# EasyEDA Pro project ProPrj_秋水小车_2026-03-26.epro

# Schematic Schematic1
Board Name: Board1; Create Date: 2025-11-21; Page Name: P1; Project Name: 秋水小车; Schematic Name: Schematic1; Update Date: 2025-11-22; Company: 嘉立创EDA; Page Size: A4; Version: V1.0
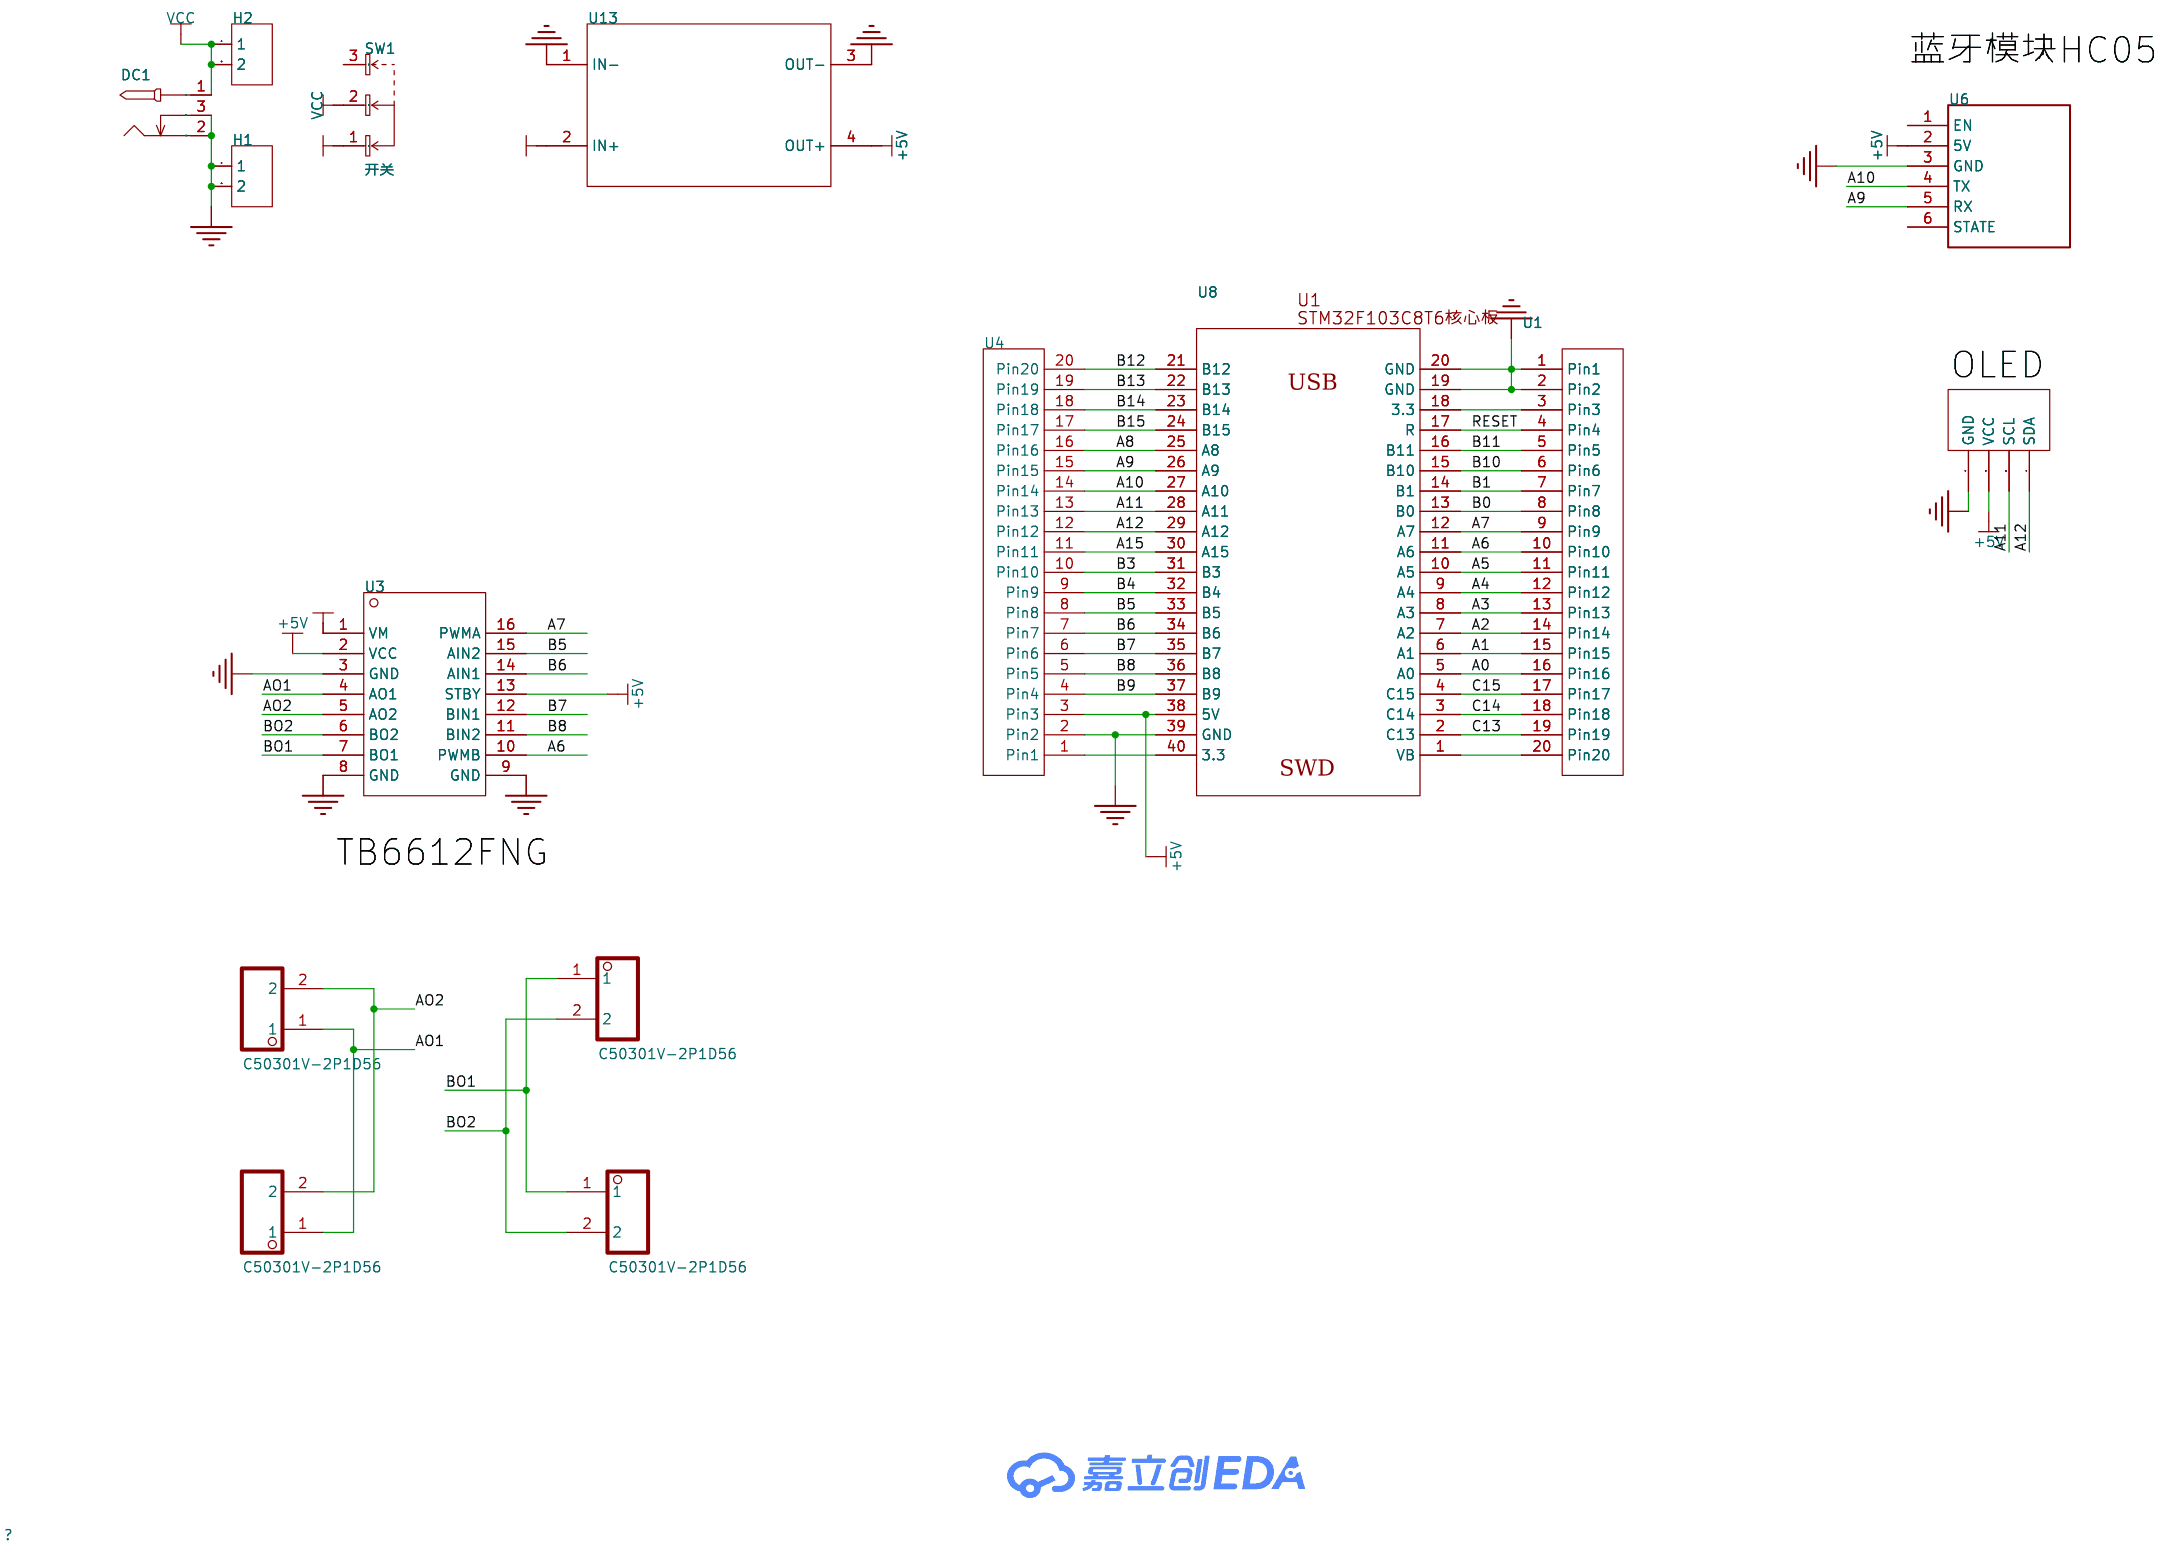
[diagram p0: schematic sheet]

## Parts
DC1  -  [DC-005_2.5]
H1  -  [HDR-TH_2P-P2.54-V-F]
H2  -  [HDR-TH_2P-P2.54-V-F]
OLED  OLED4PIN  [OLED 4PIN]
SW1  开关  [SW-TH_3P-P4.70_L11.1-W12.7]
U1  -  [20p排针]
U3  TB6612FNG  [TB6612]
U4  -  [20p排针]
U6  蓝牙模块HC05  [HC05]
U8  -  [STM32F103C8T6核心板]
U9  C50301V-2P1D56  [螺钉式接线端子]
U10  C50301V-2P1D56  [螺钉式接线端子]
U11  C50301V-2P1D56  [螺钉式接线端子]
U12  C50301V-2P1D56  [螺钉式接线端子]
U13  -  [MP1584en]

## Library data of the parts
DC1 = DC-005_2.5: Supplier Footprint: 插件
H1 H2 = HDR-F_2.54_1x2P: Supplier Part: C49661; Supplier Footprint: 插件
OLED = OLED 4PIN: _: 3
SW1 = SS-12D06L5: 电路结构:单刀双掷;安装方式:-;开关颜色:黑色;额定电流:3A;额定电压:250V;工作寿命:1万次;; LCSC Part Name: 柄长5mm 卧插双档 滑动开关; Supplier Part: C319015; Manufacturer: XKB Connection(中国星坤); Supplier Footprint: 插件,13x6.6mm; JLCPCB Part Class: 扩展库; Datasheet: https://item.szlcsc.com/datasheet/SS-12D06L5/300107.html; Supplier: LCSC; Circuit: 单刀双掷; Actuator Style: 矩形柱状; Termination Style: PC引脚; Length: 12.95mm; Width: 6.6mm; Switch Height: 6.3mm; Actuator Color: 黑色; Current Rating: 3A; Voltage Rating: 250V; Life: 1万次; Operating Temperature: -40℃~+85℃
U1 U4 = 20p排针
U3 = TB6612
U6 = HC05
U8 = STM32F103核心板
U9-U12 = 螺钉式接线端子: 低价方案
U13 = MP1584en

## Nets
+5V: OLED.2(VCC) U3.2(VCC) U3.13(STBY) U4.3(Pin3) U6.2(5V) U8.38(5V) U13.4(OUT+)
+12V: SW1.1 U3.1(VM) U13.2(IN+)
GND: DC1.2 DC1.3 H1.1 H1.2 OLED.1(GND) U1.1(Pin1) U1.2(Pin2) U3.3(GND) U3.8(GND) U3.9(GND) U4.2(Pin2) U6.3(GND) U8.19(GND) U8.20(GND) U8.39(GND) U13.1(IN-) U13.3(OUT-)
VCC: DC1.1(4) H2.1 H2.2 SW1.2
A0: U1.16(Pin16) U8.5(A0)
A1: U1.15(Pin15) U8.6(A1)
A2: U1.14(Pin14) U8.7(A2)
A3: U1.13(Pin13) U8.8(A3)
A4: U1.12(Pin12) U8.9(A4)
A5: U1.11(Pin11) U8.10(A5)
A6: U1.10(Pin10) U3.10(PWMB) U8.11(A6)
A7: U1.9(Pin9) U3.16(PWMA) U8.12(A7)
A8: U4.16(Pin16) U8.25(A8)
A9: U4.15(Pin15) U6.5(RX) U8.26(A9)
A10: U4.14(Pin14) U6.4(TX) U8.27(A10)
A11: OLED.3(SCL) U4.13(Pin13) U8.28(A11)
A12: OLED.4(SDA) U4.12(Pin12) U8.29(A12)
A15: U4.11(Pin11) U8.30(A15)
AO1: U3.4(AO1) U9.1 U10.1
AO2: U3.5(AO2) U9.2 U10.2
B0: U1.8(Pin8) U8.13(B0)
B1: U1.7(Pin7) U8.14(B1)
B3: U4.10(Pin10) U8.31(B3)
B4: U4.9(Pin9) U8.32(B4)
B5: U3.15(AIN2) U4.8(Pin8) U8.33(B5)
B6: U3.14(AIN1) U4.7(Pin7) U8.34(B6)
B7: U3.12(BIN1) U4.6(Pin6) U8.35(B7)
B8: U3.11(BIN2) U4.5(Pin5) U8.36(B8)
B9: U4.4(Pin4) U8.37(B9)
B10: U1.6(Pin6) U8.15(B10)
B11: U1.5(Pin5) U8.16(B11)
B12: U4.20(Pin20) U8.21(B12)
B13: U4.19(Pin19) U8.22(B13)
B14: U4.18(Pin18) U8.23(B14)
B15: U4.17(Pin17) U8.24(B15)
BO1: U3.7(BO1) U11.1 U12.1
BO2: U3.6(BO2) U11.2 U12.2
C13: U1.19(Pin19) U8.2(C13)
C14: U1.18(Pin18) U8.3(C14)
C15: U1.17(Pin17) U8.4(C15)
RESET: U1.4(Pin4) U8.17(R)
$1N2688: U1.3(Pin3) U8.18(3.3)
$1N2777: U1.20(Pin20) U8.1(VB)
$1N2896: U4.1(Pin1) U8.40(3.3)

Not connected (* = marked no-connect by the designer): SW1 3; U6 1(EN) 6(STATE)

# Board PCB1
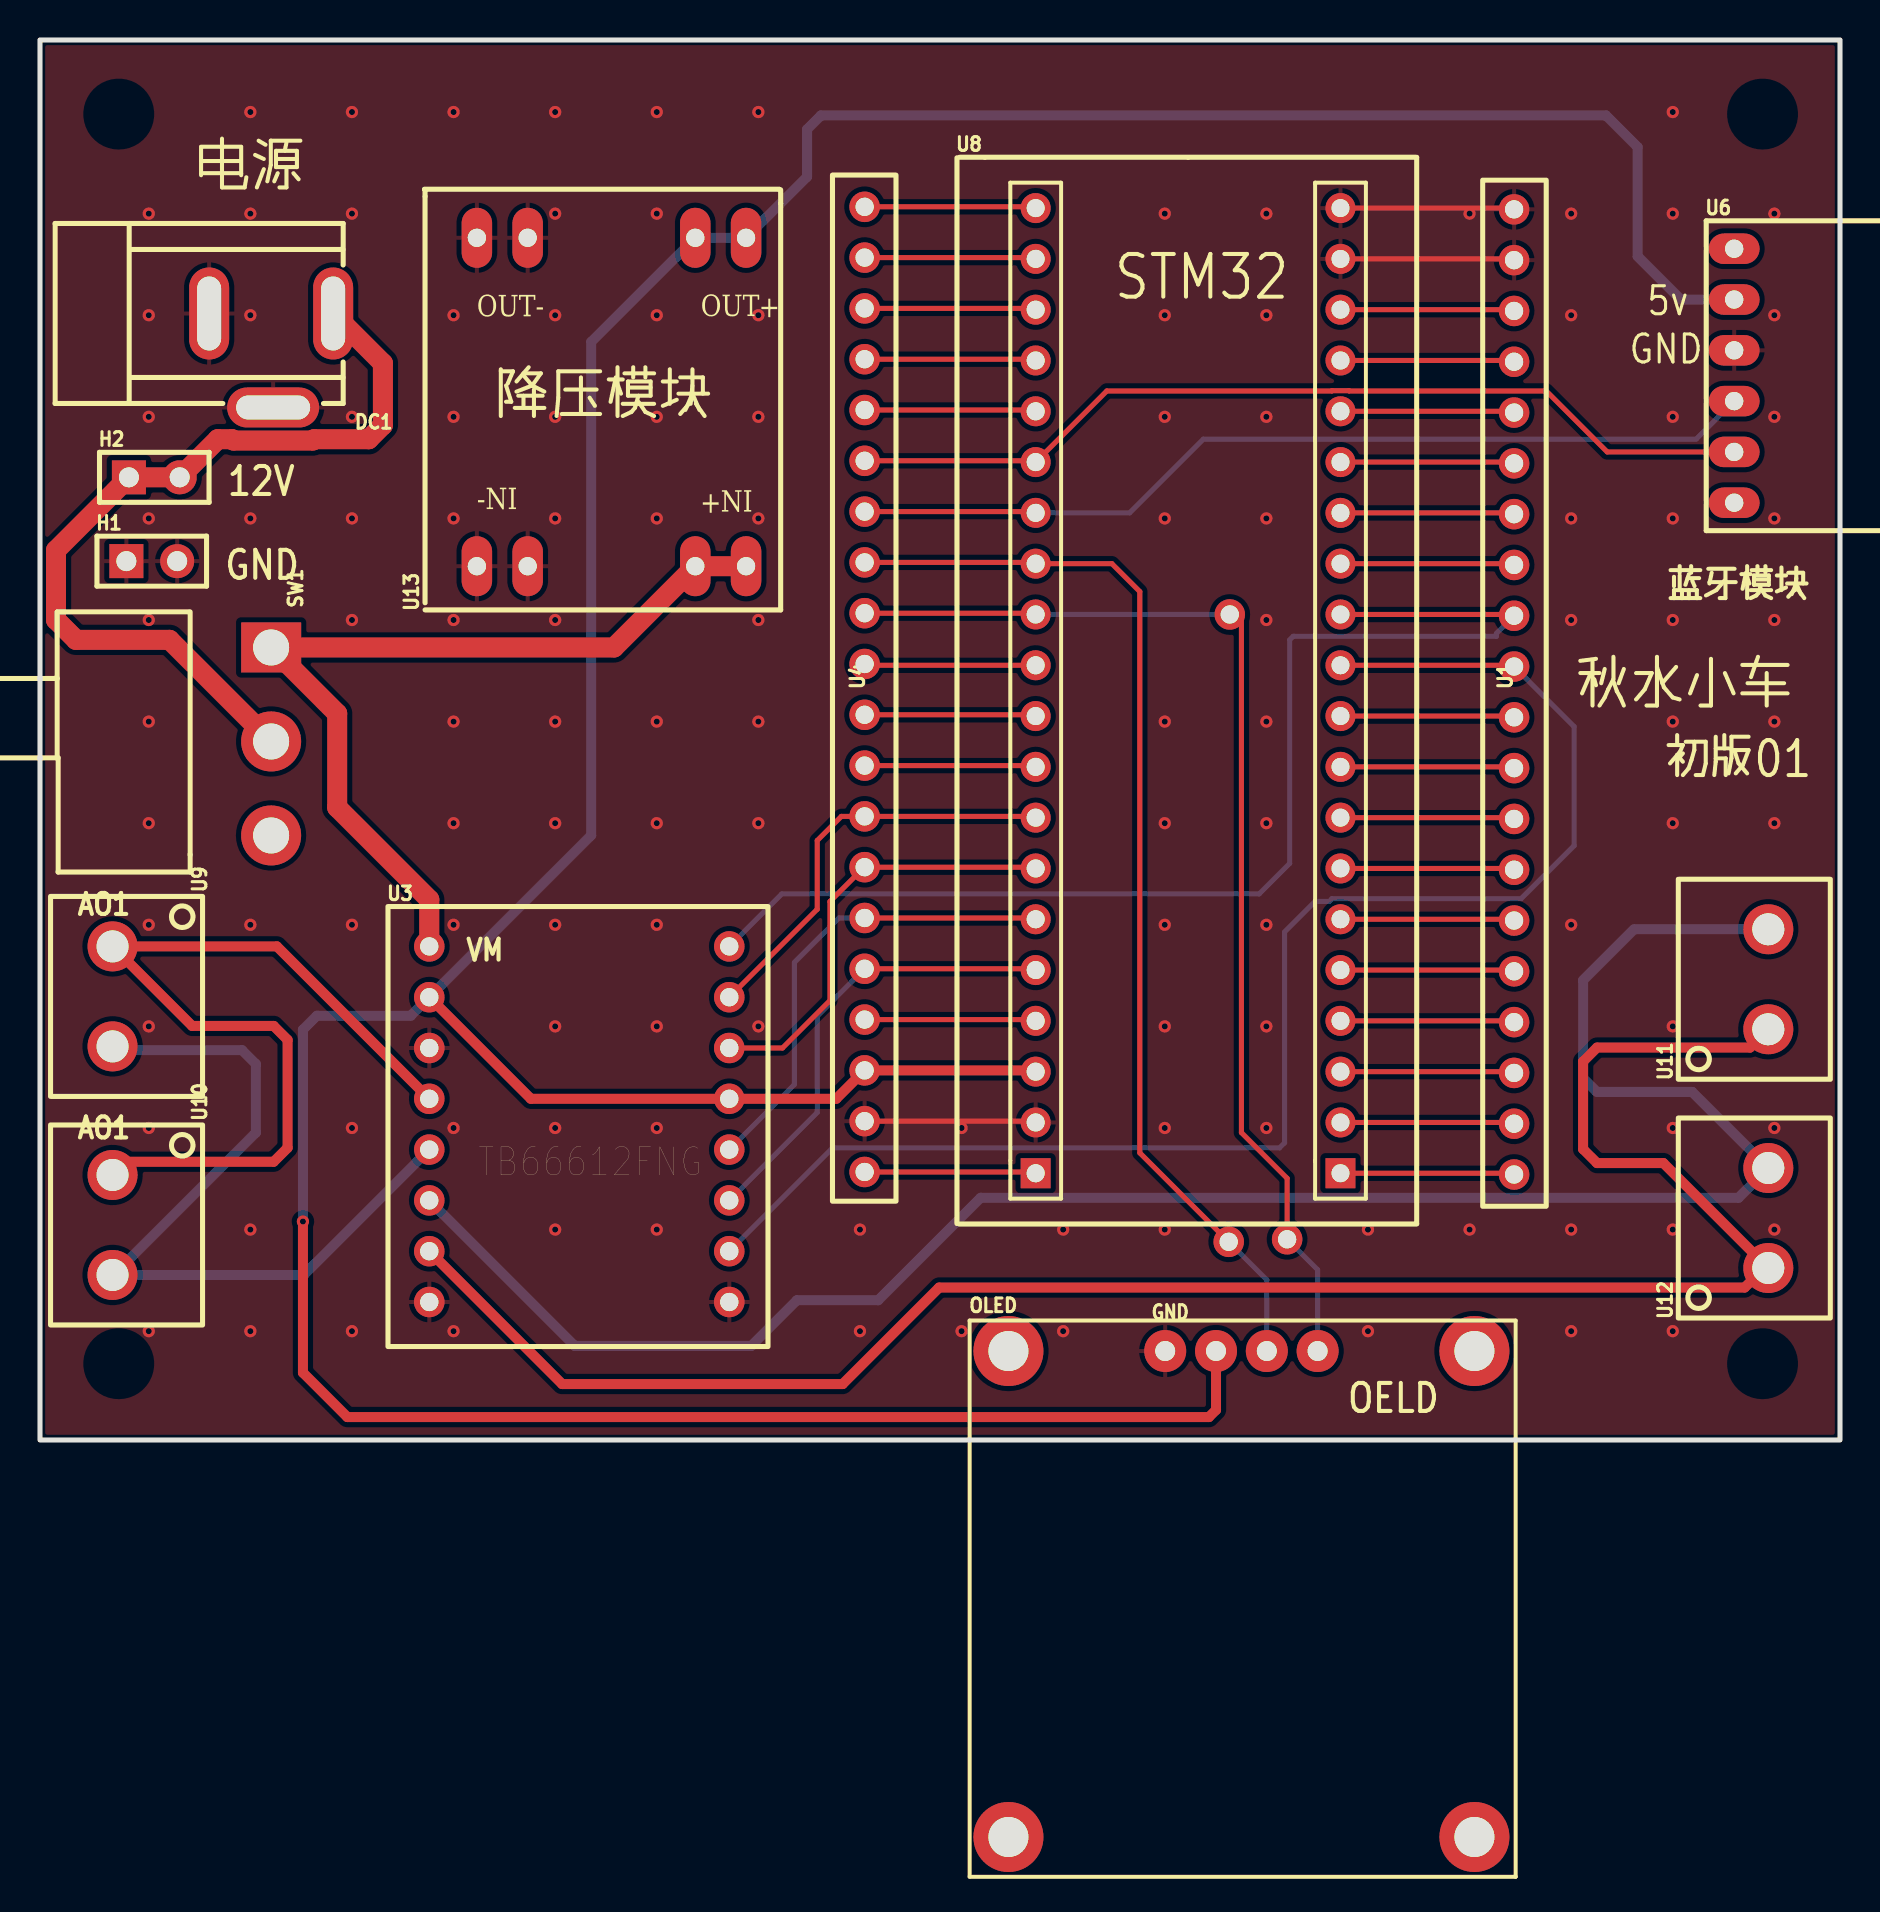
[diagram p1: board, top side]
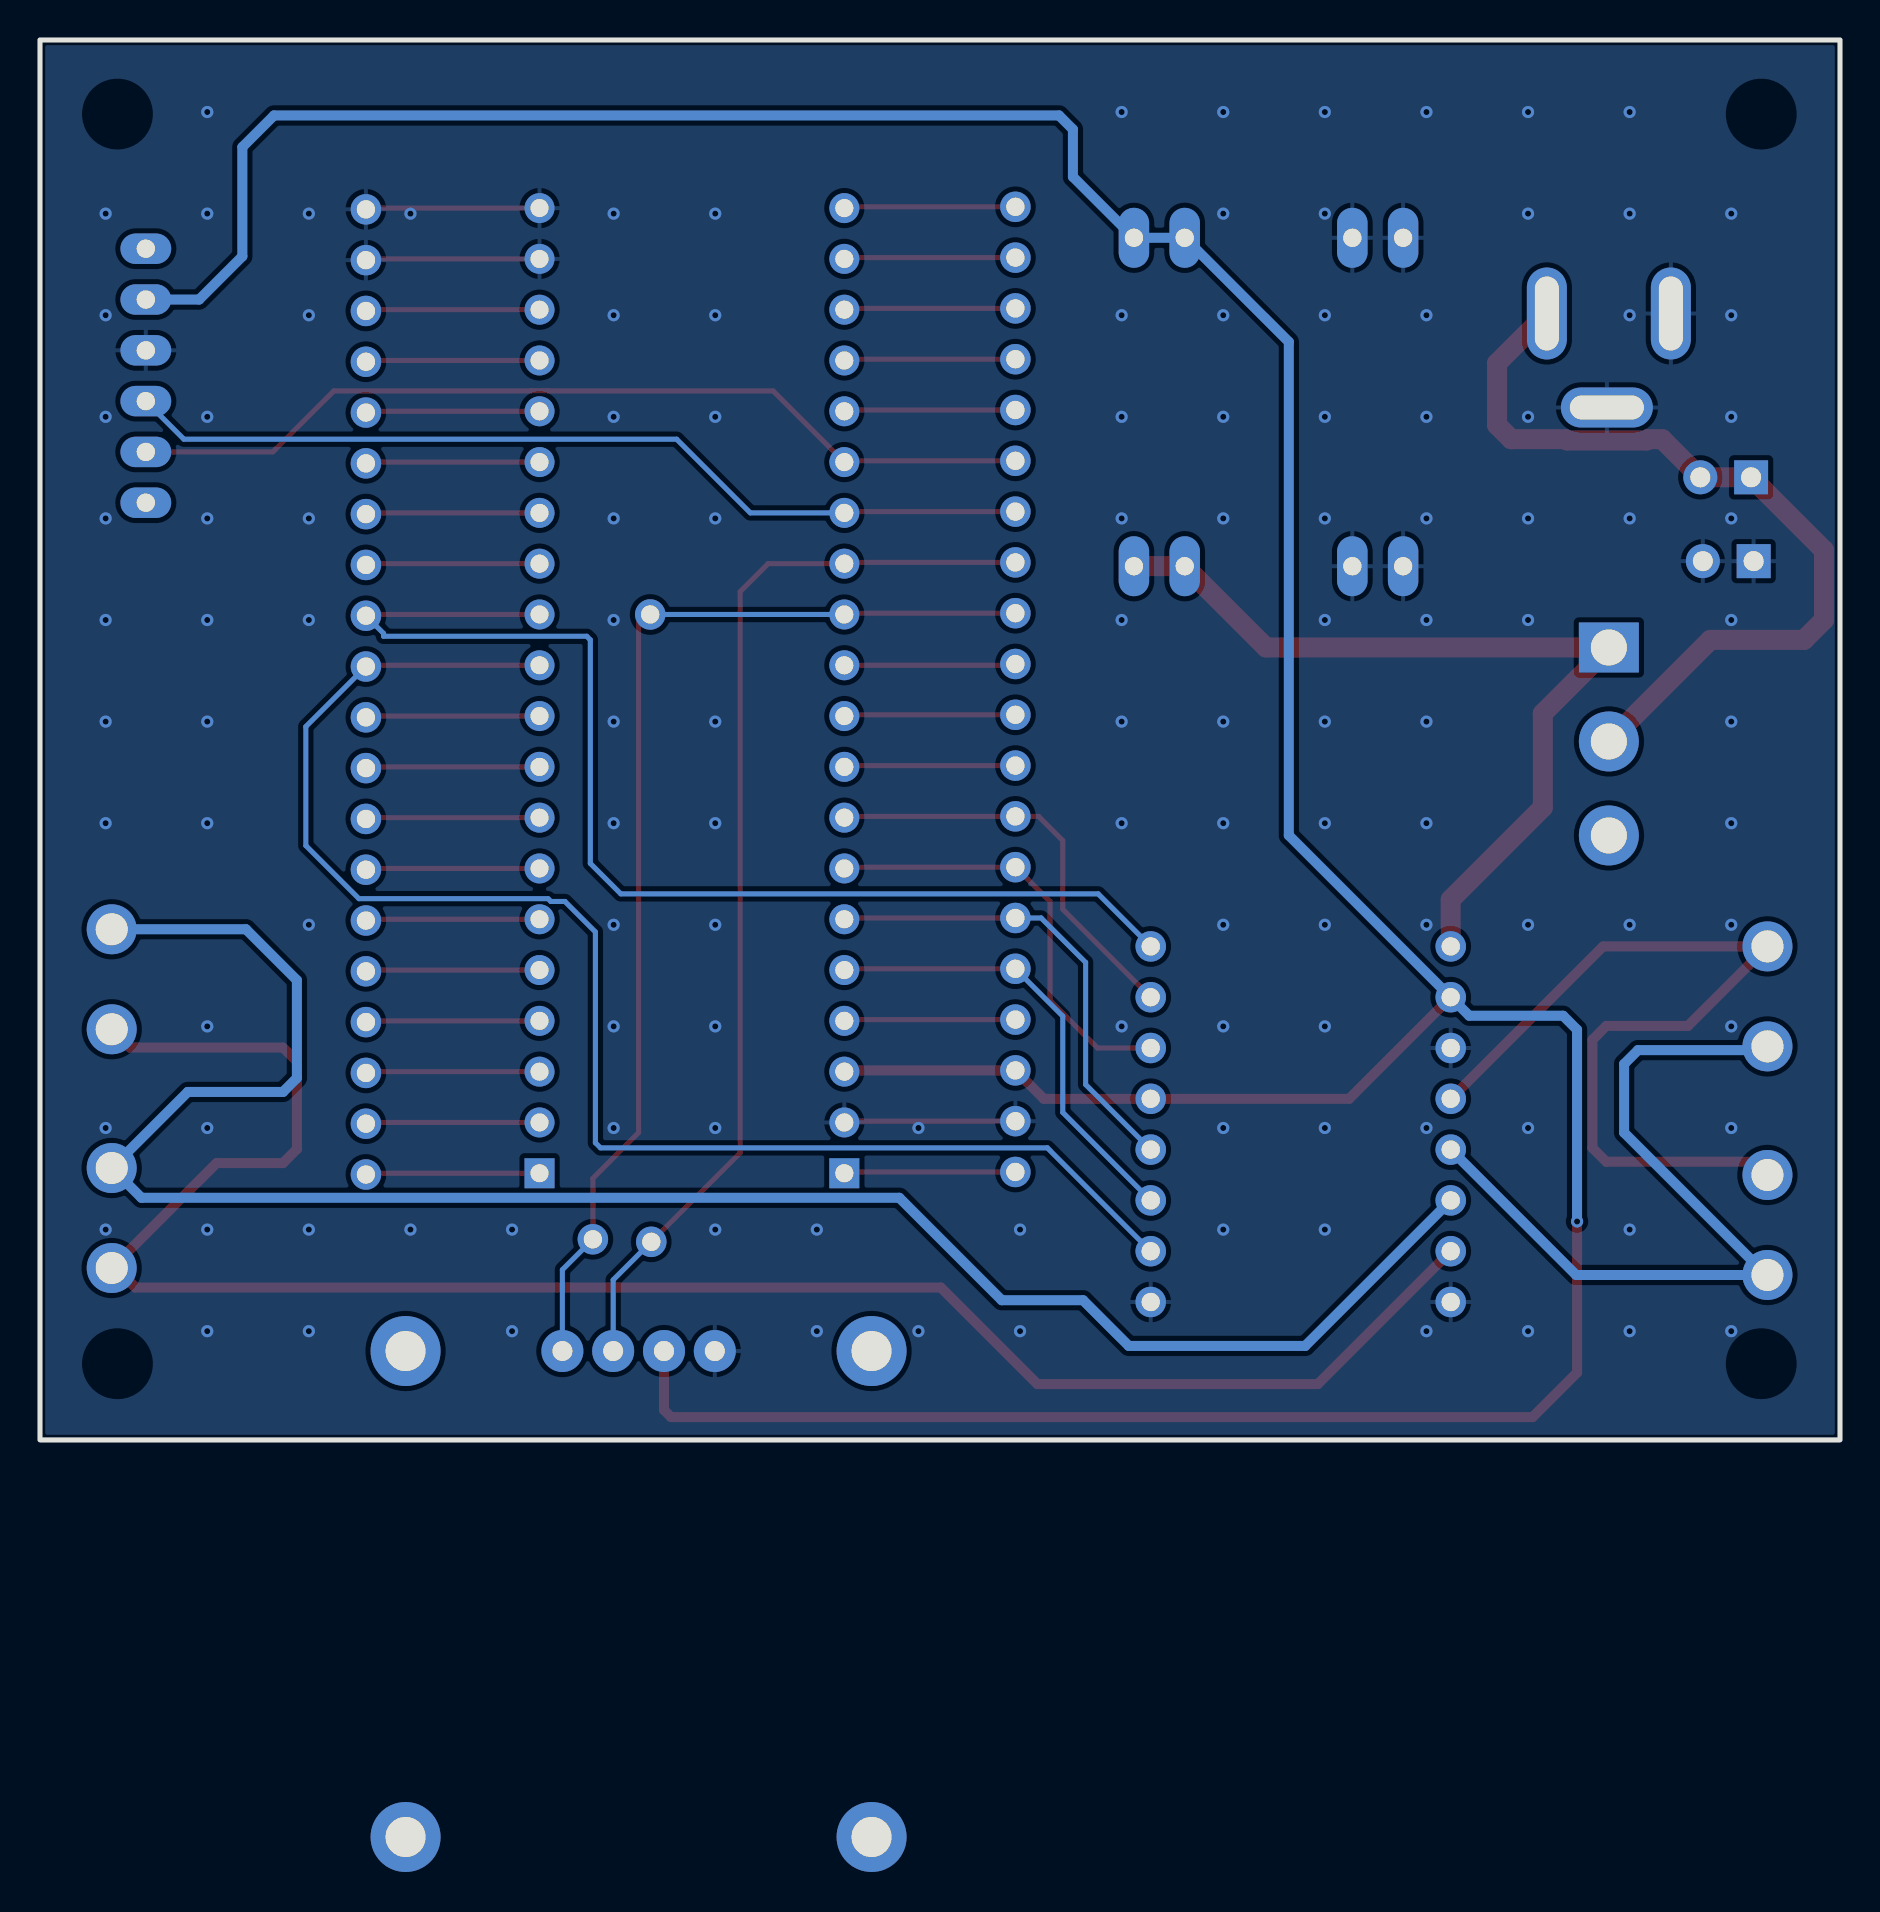
[diagram p2: board, bottom side, seen from below]

Outline 90 x 70 mm; copper layers: Top Layer, Bottom Layer. Coordinates in mm from the lower left corner of the outline.
Outline path: rectangle 0,70 90,0
Stack: Top Layer 0.035mm / Dielectric1 1.51mm FR4 er 4.5 / Bottom Layer 0.035mm

## Design rules (mm)
template: JLCPCB Capability(Two Layers Board)
spacing copperThickness1oz (default): track to track 0.102, other pairs 0.152 to 0.3
spacing copperThickness2oz: track to track 0.203, other pairs 0.152 to 0.3
track width copperThickness1oz (default): min 0.127, default 0.254, max 2.54
track width copperThickness2oz: min 0.203, default 0.254, max 2.54
differential pair differentialPair (default): width min 0.127, default 0.254, max 2.54; gap min 0.152, default 0.152
via viaSize (default): diameter min 0.5, default 0.61, max 10; hole min 0.3, default 0.305, max 6.3

## Placement (name value [footprint] x y rotation side)
DC1  -  [DC-005_2.5]  11.43 56.01 180 top
H1  -  [HDR-TH_2P-P2.54-V-F]  5.59 43.94 0 top
H2  -  [HDR-TH_2P-P2.54-V-F]  5.72 48.13 0 top
NOREF  -  [Pad_e2007]  59.44 9.91 0 top
NOREF#2  -  [Pad_e2040]  59.49 41.27 0 top
NOREF#3  -  [Pad_e2032]  62.36 10.03 0 top
OLED  OLED4PIN  [OLED 4PIN]  56.26 4.44 0 top
SW1  开关  [SW-TH_3P-P4.70_L11.1-W12.7]  11.56 34.92 270 top
U1  -  [20p排针]  73.66 37.46 270 top
U3  TB6612FNG  [TB6612]  29.46 19.18 0 top
U4  -  [20p排针]  41.28 37.46 90 top
U6  蓝牙模块HC05  [HC05]  84.71 59.56 0 top
U8  -  [STM32F103C8T6核心板]  45.72 10.82 0 top
U9  C50301V-2P1D56  [螺钉式接线端子]  8.13 27.18 270 top
U10  C50301V-2P1D56  [螺钉式接线端子]  8.13 15.75 270 top
U11  C50301V-2P1D56  [螺钉式接线端子]  81.91 18.03 90 top
U12  C50301V-2P1D56  [螺钉式接线端子]  81.91 6.1 90 top
U13  -  [MP1584en]  21.84 43.69 90 top

## Footprints (pads in the part's own frame, mm; a bottom-side part is the same pattern mirrored in y, then rotated)
20p排针
  round 1.524 hole 0.914: 1(-24.067,0.044) 2(-21.526,0.044) 3(-18.986,0.044) 4(-16.447,0.044) 5(-13.906,0.044) 6(-11.367,0.044) 7(-8.826,0.044) 8(-6.287,0.044) 9(-3.747,0.044) 10(-1.206,0.044) 11(1.333,0.044) 12(3.873,0.044) 13(6.413,0.044) 14(8.954,0.044) 15(11.493,0.044) 16(14.034,0.044) 17(16.573,0.044) 18(19.113,0.044) 19(21.654,0.044) 20(24.194,0.044)
DC-005_2.5
  oval 2x4.6 hole 1.2x3.7: 1(-3.227,-0.318) 2(2.973,-0.318)
  oval 4.6x2 hole 3.7x1.2: 3(-0.227,4.382)
HC05
  oval 2.54x1.524 hole 0.914: 1(0,0) 2(0,-2.54) 3(0,-5.08) 4(0,-7.62) 5(0,-10.16) 6(0,-12.7)
HDR-TH_2P-P2.54-V-F
  rect 1.7x1.7 hole 1: 1(-1.27,0)
  round 1.7 hole 1: 2(1.27,0)
MP1584en
  oval 2.999x1.524 hole 0.914: 1(0,0) 1(0,-2.54) 2(0,-10.919) 2(0,-13.46) 3(16.421,0) 3(16.421,-2.54) 4(16.421,-10.919) 4(16.421,-13.46)
OLED 4PIN
  round 3.5 hole 2: 0(-7.84,0) 0(-7.84,-24.3) 0(15.46,0) 0(15.46,-24.3)
  round 2.1 hole 1: 1(0,0) 2(2.54,0) 3(5.08,0) 4(7.62,0)
Pad_e2007
  round 1.524 hole 0.914: 1(0,0)
Pad_e2032
  round 1.524 hole 0.914: 1(0,0)
Pad_e2040
  round 1.524 hole 0.914: 1(0,0)
STM32F103C8T6核心板
  rect 1.5x1.5 hole 0.9: 1(19.304,2.514)
  round 1.5 hole 0.9: 2(19.304,5.054) 3(19.304,7.595) 4(19.304,10.134) 5(19.304,12.675) 6(19.304,15.214) 7(19.304,17.755) 8(19.304,20.294) 9(19.304,22.834) 10(19.304,25.375) 11(19.304,27.915) 12(19.304,30.454) 14(19.304,35.535) 18(19.304,45.694) 19(19.304,48.234) 20(19.304,50.775)
  round 1.5 hole 0.9x0.905: 13(19.304,32.995) 15(19.304,38.075) 16(19.304,40.614) 17(19.304,43.154) 21(4.064,50.775) 22(4.064,48.234) 23(4.064,45.694) 24(4.064,43.154) 25(4.064,40.614) 26(4.064,38.075) 27(4.064,35.535) 28(4.064,32.995) 29(4.064,30.454) 30(4.064,27.915) 31(4.064,25.375) 32(4.064,22.834) 33(4.064,20.294) 34(4.064,17.755) 35(4.064,15.214) 36(4.064,12.675) 37(4.064,10.134) 38(4.064,7.595) 39(4.064,5.054)
  rect 1.5x1.5 hole 0.9x0.905: 40(4.064,2.514)
SW-TH_3P-P4.70_L11.1-W12.7
  rect 2.5x3 hole 1.8: 1(-4.7,0)
  round 3 hole 1.8: 2(0,0) 3(4.7,0)
TB6612
  round 1.524 hole 0.914: 1(-10,5.5) 2(-10,2.96) 3(-10,0.42) 4(-10,-2.12) 5(-10,-4.66) 6(-10,-7.2) 7(-10,-9.74) 8(-10,-12.28) 9(5,-12.28) 10(5,-9.74) 11(5,-7.2) 12(5,-4.66) 13(5,-2.12) 14(5,0.42) 15(5,2.96) 16(5,5.5)
螺钉式接线端子
  round 2.5 hole 1.6: 1(2.5,-4.5) 2(7.5,-4.5)

## Nets
As in the schematic, except:
A11: NOREF.1 OLED.3 U4.13 U8.28
A12: NOREF#2.1 NOREF#3.1 OLED.4 U4.12 U8.29

Pads without a net: OLED 0; SW1 3; U6 1 6

## Via types
v1: diameter 0.61, hole 0.305, Top Layer to Bottom Layer, 125 vias

## Routing (per net, layer and track width the routed paths; a pad name or vN(x,y) marks a point on that pad's centre or on a via; arc(x,y) is an arc through that point)
+5V: length 213.2
  Top Layer w0.5: OLED.2 58.8,1.5 58.45,1.14 15.37,1.14 13.15,3.36 v1(13.15,10.92) ; U8.38 49.72,18.48 U4.3 39.81,17.06 U3.13 24.54,17.06 U3.2
  Bottom Layer w0.5: v1(13.15,10.92) 13.15,20.51 13.84,21.21 18.54,21.21 U3.2 27.56,30.23 27.56,54.9 U13.4 U13.4 38.35,63.16 38.35,65.53 39.05,66.23 78.3,66.23 79.88,64.64 79.88,59.18 82.04,57.02 U6.2
+12V: length 43.7
  Top Layer w1: U3.1 19.46,27.02 14.86,31.62 14.86,36.32 SW1.1 28.7,39.62 U13.2 U13.2
GND: length 26
  Top Layer w0.254: U1.2 73.64,59.05 U8.19 ; U4.2 49.72,15.94 U8.39 ; U1.1 73.64,61.59 U8.20
  vias: v1(5.44,61.32) v1(5.44,56.24) v1(5.44,51.16) v1(5.44,46.08) v1(5.44,41) v1(5.44,35.92) v1(5.44,30.84) v1(5.44,25.76) v1(5.44,20.68) v1(5.44,15.6) v1(5.44,5.44) v1(10.52,66.4) v1(10.52,61.32) v1(10.52,56.24) v1(10.52,46.08) v1(10.52,25.76) v1(10.52,10.52) v1(10.52,5.44) v1(15.6,66.4) v1(15.6,61.32) v1(15.6,51.16) v1(15.6,46.08) v1(15.6,41) v1(15.6,25.76) v1(15.6,15.6) v1(15.6,5.44) v1(20.68,66.4) v1(20.68,56.24) v1(20.68,51.16) v1(20.68,46.08) v1(20.68,41) v1(20.68,35.92) v1(20.68,30.84) v1(20.68,25.76) v1(20.68,15.6) v1(20.68,5.44) v1(25.76,66.4) v1(25.76,61.32) v1(25.76,56.24) v1(25.76,51.16) v1(25.76,46.08) v1(25.76,41) v1(25.76,35.92) v1(25.76,30.84) v1(25.76,25.76) v1(25.76,20.68) v1(25.76,15.6) v1(25.76,10.52) v1(30.84,66.4) v1(30.84,61.32) v1(30.84,56.24) v1(30.84,51.16) v1(30.84,46.08) v1(30.84,35.92) v1(30.84,30.84) v1(30.84,25.76) v1(30.84,20.68) v1(30.84,15.6) v1(30.84,10.52) v1(35.92,66.4) v1(35.92,56.24) v1(35.92,51.16) v1(35.92,46.08) v1(35.92,41) v1(35.92,35.92) v1(35.92,30.84) v1(35.92,20.68) v1(41,10.52) v1(41,5.44) v1(46.08,15.6) v1(46.08,5.44) v1(51.16,10.52) v1(51.16,5.44) v1(56.24,61.32) v1(56.24,56.24) v1(56.24,51.16) v1(56.24,46.08) v1(56.24,35.92) v1(56.24,30.84) v1(56.24,25.76) v1(56.24,20.68) v1(56.24,15.6) v1(56.24,10.52) v1(61.32,61.32) v1(61.32,56.24) v1(61.32,51.16) v1(61.32,46.08) v1(61.32,41) v1(61.32,35.92) v1(61.32,30.84) v1(61.32,25.76) v1(61.32,20.68) v1(61.32,15.6) v1(66.4,10.52) v1(66.4,5.44) v1(71.48,61.32) v1(71.48,10.52) v1(76.56,61.32) v1(76.56,56.24) v1(76.56,46.08) v1(76.56,41) v1(76.56,25.76) v1(76.56,10.52) v1(76.56,5.44) v1(81.64,66.4) v1(81.64,61.32) v1(81.64,51.16) v1(81.64,46.08) v1(81.64,41) v1(81.64,35.92) v1(81.64,30.84) v1(81.64,20.68) v1(81.64,15.6) v1(81.64,10.52) v1(81.64,5.44) v1(86.72,61.32) v1(86.72,56.24) v1(86.72,51.16) v1(86.72,46.08) v1(86.72,41) v1(86.72,35.92) v1(86.72,30.84) v1(86.72,15.6) v1(86.72,10.52)
VCC: length 42.4
  Top Layer w1: SW1.2 6.48,40 1.8,40 0.8,41 0.8,44.49 4.44,48.13 H2.2 8.89,50.04 9.61,50.04 9.67,49.97 13.64,49.97 13.71,50.04 16.44,50.04 17.14,50.74 17.14,53.84 14.66,56.32
A0: length 8.7
  Top Layer w0.254: U1.16 73.64,23.49 U8.5
A1: length 8.7
  Top Layer w0.254: U1.15 73.64,26.03 U8.6
A2: length 8.7
  Top Layer w0.254: U1.14 73.64,28.57 U8.7
A3: length 8.7
  Top Layer w0.254: U8.8 73.64,31.11 U1.13
A4: length 8.7
  Top Layer w0.254: U8.9 73.64,33.65 U1.12
A5: length 8.7
  Top Layer w0.254: U1.11 73.64,36.19 U8.10
A6: length 75.7
  Top Layer w0.254: U1.10 73.64,38.73 U8.11
  Bottom Layer w0.254: U1.10 76.71,35.67 76.71,29.72 74.05,27.06 64.6,27.06 64.46,26.92 63.75,26.92 62.23,25.4 62.23,14.86 61.98,14.6 39.63,14.6 U3.10
A7: length 61.4
  Top Layer w0.254: U8.12 73.64,41.27 U1.9
  Bottom Layer w0.254: U1.9 72.82,40.33 72.82,40.18 62.66,40.18 62.48,40 62.48,28.83 60.96,27.3 37.09,27.3 U3.16
A8: length 8.6
  Top Layer w0.254: U4.16 49.72,51.5 U8.25
A9: length 46.3
  Top Layer w0.254: U6.5 78.36,49.4 75.31,52.45 65.46,52.45 65.45,52.46 64.6,52.46 64.59,52.45 53.34,52.45 U8.26 49.72,48.96 U4.15
A10: length 45.8
  Top Layer w0.254: U4.14 49.72,46.42 U8.27
  Bottom Layer w0.254: U8.27 54.48,46.35 58.17,50.04 82.8,50.04 U6.4
A11: length 55
  Top Layer w0.254: U4.13 49.72,43.88 U8.28 53.59,43.81 54.99,42.42 54.99,14.35 NOREF.1
  Bottom Layer w0.254: OLED.3 61.34,8 NOREF.1
A12: length 56.8
  Top Layer w0.254: 59.82,41.27 60.07,41.02 60.07,15.37 62.36,13.08 NOREF#3.1 ; U4.12 49.72,41.34 U8.29
  Bottom Layer w0.254: NOREF#3.1 63.88,8.51 OLED.4 ; NOREF#2.1 U8.29
A15: length 8.6
  Top Layer w0.254: U8.30 41.29,38.73 U4.11
AO1: length 44.4
  Top Layer w0.5: U3.4 11.84,24.68 U9.1 7.61,20.7 11.68,20.7 12.38,20 12.38,14.6 11.68,13.91 4.29,13.91 U10.1
AO2: length 39.5
  Bottom Layer w0.5: U9.2 3.81,19.49 10.1,19.49 10.8,18.8 10.8,15.37 3.68,8.25 ; 3.68,8.25 U10.2 ; 3.68,8.25 13.19,8.25 U3.5
B0: length 8.7
  Top Layer w0.254: U8.13 73.64,43.81 U1.8
B1: length 8.7
  Top Layer w0.254: U1.7 73.64,46.35 U8.14
B3: length 8.6
  Top Layer w0.254: U8.31 49.72,36.26 U4.10
B4: length 8.6
  Top Layer w0.254: U8.32 49.72,33.72 U4.9
B5: length 21.1
  Top Layer w0.254: U3.15 38.86,26.53 38.86,29.97 40.07,31.18 U4.8 49.72,31.18 U8.33
B6: length 22
  Top Layer w0.254: U3.14 37.12,19.6 39.5,21.97 39.5,26.92 41.21,28.64 U4.7 49.72,28.64 U8.34
B7: length 23.7
  Top Layer w0.254: U4.6 49.72,26.1 U8.35
  Bottom Layer w0.254: U4.6 39.94,26.1 37.72,23.88 37.72,17.77 U3.12
B8: length 23
  Top Layer w0.254: U4.5 49.72,23.56 U8.36
  Bottom Layer w0.254: U3.11 38.86,16.37 38.86,21.19 U4.5
B9: length 8.6
  Top Layer w0.254: U8.37 49.72,21.02 U4.4
B10: length 8.7
  Top Layer w0.254: U1.6 73.64,48.89 U8.15
B11: length 8.7
  Top Layer w0.254: U8.16 73.64,51.43 U1.5
B12: length 8.6
  Top Layer w0.254: U8.21 49.72,61.66 U4.20
B13: length 8.6
  Top Layer w0.254: U4.19 49.72,59.12 U8.22
B14: length 8.6
  Top Layer w0.254: U8.23 49.72,56.58 U4.18
B15: length 8.6
  Top Layer w0.254: U8.24 49.72,54.04 U4.17
BO1: length 98.1
  Top Layer w0.5: 86.31,8.7 85.23,7.62 44.96,7.62 40.13,2.79 26.11,2.79 U3.7 ; 86.31,8.7 U12.1 ; 86.31,8.7 81.17,13.84 77.85,13.84 77.16,14.54 77.16,18.92 77.85,19.62 85.5,19.62 U11.1
BO2: length 100
  Bottom Layer w0.5: U3.6 26.74,4.7 35.56,4.7 37.85,6.98 41.91,6.98 47.03,12.11 84.93,12.11 U12.2 82.61,17.4 77.85,17.4 77.16,18.09 77.16,22.99 79.7,25.53 U11.2
C13: length 8.7
  Top Layer w0.254: U8.2 73.64,15.87 U1.19
C14: length 8.7
  Top Layer w0.254: U8.3 73.64,18.41 U1.18
C15: length 8.7
  Top Layer w0.254: U1.17 73.64,20.95 U8.4
RESET: length 8.7
  Top Layer w0.254: U1.4 73.64,53.97 U8.17
$1N2688: length 8.7
  Top Layer w0.254: U1.3 73.64,56.51 U8.18
$1N2777: length 8.7
  Top Layer w0.254: U8.1 73.64,13.33 U1.20
$1N2896: length 8.6
  Top Layer w0.254: U8.40 49.72,13.4 U4.1

## Copper pours and planes (outline as drawn; the poured copper is in the pictures)
GND on Top Layer: -13.84,74.93 113.41,74.93 113.41,-7.11 -13.84,-7.11
GND on Bottom Layer: -14.1,74.93 113.66,74.93 113.66,-7.11 -14.1,-7.11

## Text on the board
Top Silkscreen Layer: GND | AO1 | VM | TB66612FNG | 5v | 12V | OELD | STM32 | OUT- | -NI | OUT+ | +NI | 蓝牙模块 | 初版01 | 电源 | 降压模块 | 秋水小车
